# EAGLE schematic sequencer (EAGLE 9.6.1)
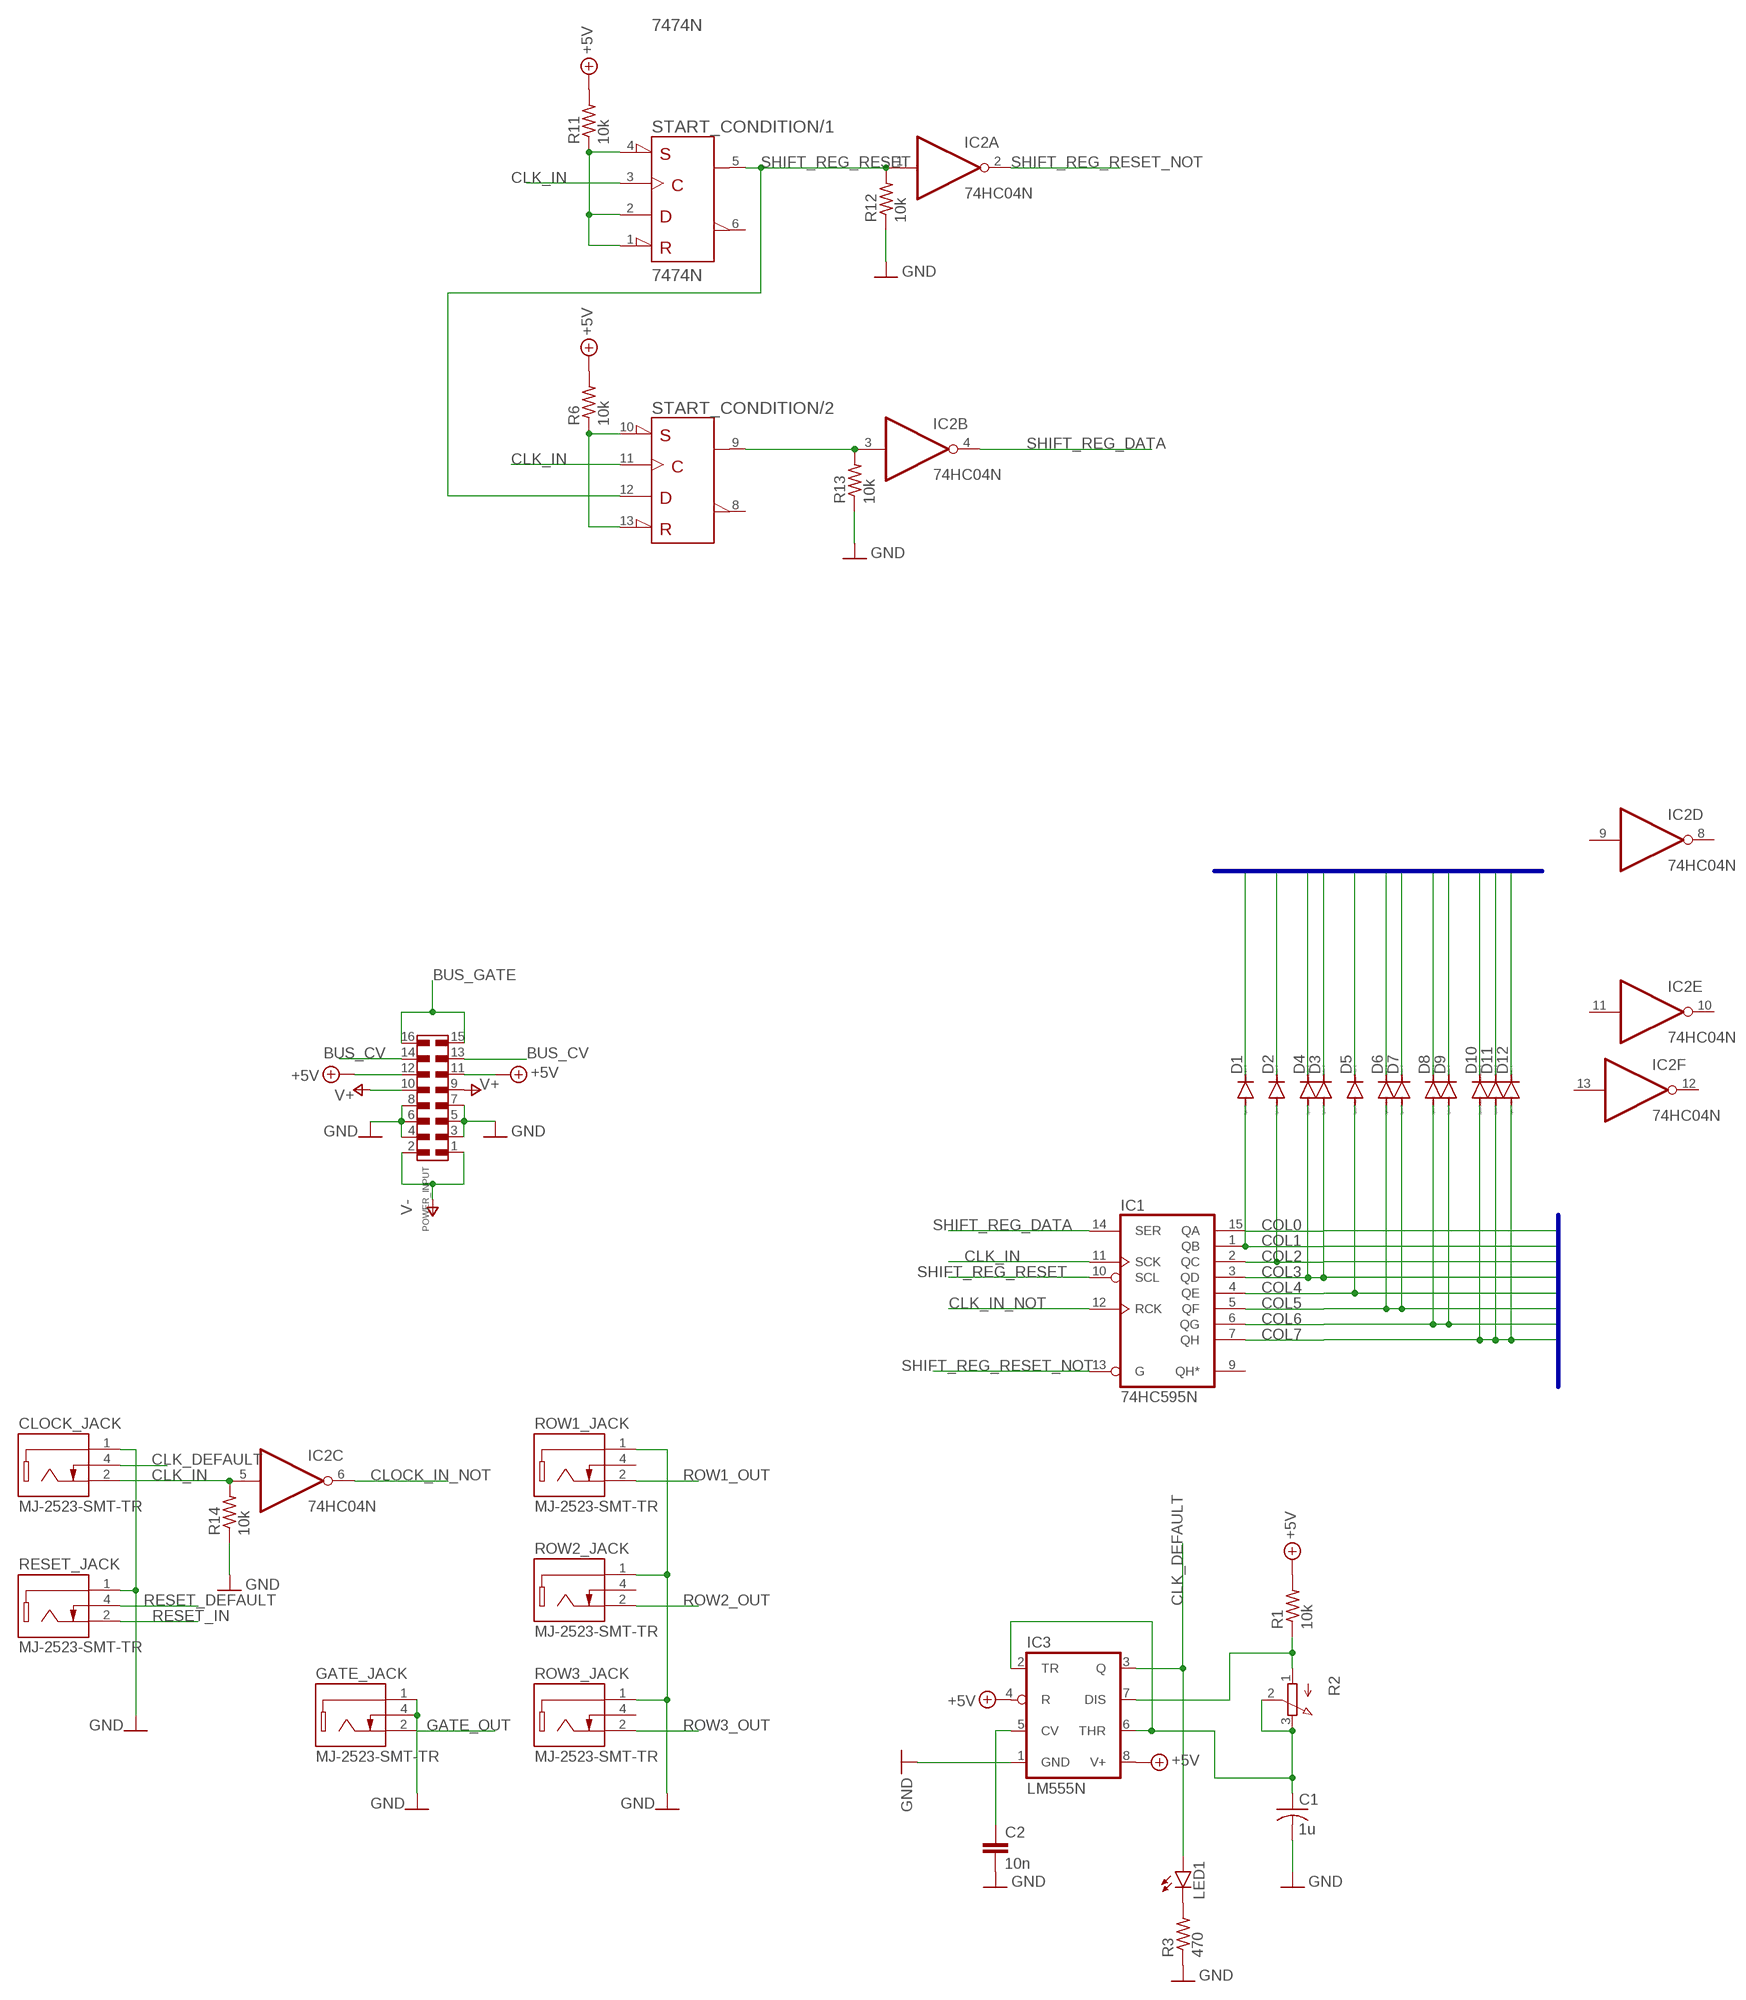
[diagram p0: schematic, sheet 1]

## Parts
C1  1u  C-US025-024X044  [C025-024X044]
C2  10n  C-EU025-024X044  [C025-024X044]
CLOCK_JACK  MJ-2523-SMT-TR  [MJ-2523-SMT-TR]
D1  DIODE-DO34-7  [DO34-7]
D2  DIODE-DO34-7  [DO34-7]
D3  DIODE-DO34-7  [DO34-7]
D4  DIODE-DO34-7  [DO34-7]
D5  DIODE-DO34-7  [DO34-7]
D6  DIODE-DO34-7  [DO34-7]
D7  DIODE-DO34-7  [DO34-7]
D8  DIODE-DO34-7  [DO34-7]
D9  DIODE-DO34-7  [DO34-7]
D10  DIODE-DO34-7  [DO34-7]
D11  DIODE-DO34-7  [DO34-7]
D12  DIODE-DO34-7  [DO34-7]
GATE_JACK  MJ-2523-SMT-TR  [MJ-2523-SMT-TR]
IC1  74HC595N  [DIL16]
IC2  74HC04N  [DIL14]
IC3  LM555N  [DIL08]
LED1  LED3MM  [LED3MM]
POWER_INPUT  6120XX20621_61201620621  [61201620621]
R1  10k  R-US_0204/7  [0204/7]
R2  3RP/1610N  [3RP/1610N]
R3  470  R-US_0204/7  [0204/7]
R6  10k  R-US_0204/7  [0204/7]
R11  10k  R-US_0204/7  [0204/7]
R12  10k  R-US_0204/7  [0204/7]
R13  10k  R-US_0204/7  [0204/7]
R14  10k  R-US_0204/7  [0204/7]
RESET_JACK  MJ-2523-SMT-TR  [MJ-2523-SMT-TR]
ROW1_JACK  MJ-2523-SMT-TR  [MJ-2523-SMT-TR]
ROW2_JACK  MJ-2523-SMT-TR  [MJ-2523-SMT-TR]
ROW3_JACK  MJ-2523-SMT-TR  [MJ-2523-SMT-TR]
START_CONDITION  7474N  [DIL14]

## Nets
+5V: IC3.4(R) IC3.8(V+) POWER_INPUT.11 POWER_INPUT.12 R1.2 R6.2 R11.2
BUS_CV: POWER_INPUT.13 POWER_INPUT.14
BUS_GATE: POWER_INPUT.15 POWER_INPUT.16
CLK_DEFAULT: CLOCK_JACK.4(TIP_SWITCH) IC3.3(Q) LED1.A
CLK_IN: CLOCK_JACK.2(TIP) IC1.11(SCK) IC2.5(C:I) R14.2 START_CONDITION.3(/1:CLK) START_CONDITION.11(/2:CLK)
CLK_IN_NOT: IC1.12(RCK)
CLOCK_IN_NOT: IC2.6(C:O)
COL0: IC1.15(QA)
COL1: D1.A IC1.1(QB)
COL2: D2.A IC1.2(QC)
COL3: D3.A D4.A IC1.3(QD)
COL4: D5.A IC1.4(QE)
COL5: D6.A D7.A IC1.5(QF)
COL6: D8.A D9.A IC1.6(QG)
COL7: D10.A D11.A D12.A IC1.7(QH)
GATE_OUT: GATE_JACK.2(TIP)
GND: C1.2 C2.2 CLOCK_JACK.1(SLEEVE) GATE_JACK.1(SLEEVE) GATE_JACK.4(TIP_SWITCH) IC3.1(GND) POWER_INPUT.3 POWER_INPUT.4 POWER_INPUT.5 POWER_INPUT.6 POWER_INPUT.7 POWER_INPUT.8 R3.1 R12.1 RESET_JACK.1(SLEEVE) ROW1_JACK.1(SLEEVE) ROW2_JACK.1(SLEEVE) ROW3_JACK.1(SLEEVE)
GND1: R13.1 ; supply symbol labelled GND
GND2: R14.1 ; supply symbol labelled GND
N$8: C2.1 IC3.5(CV)
N$9: C1.1 IC3.2(TR) IC3.6(THR) R2.2(S) R2.3(E)
N$10: LED1.K(C) R3.2
N$11: IC3.7(DIS) R1.1 R2.1(A)
N$15: R6.1 START_CONDITION.10(/2:!PRE) START_CONDITION.13(/2:!CLR)
N$16: IC2.3(B:I) R13.2 START_CONDITION.9(/2:Q)
N$24: R11.1 START_CONDITION.1(/1:!CLR) START_CONDITION.2(/1:D) START_CONDITION.4(/1:!PRE)
PLACE1: D1.C D4.C D6.C D10.C
PLACE2: D2.C D3.C D8.C D11.C
PLACE3: D5.C D7.C D9.C D12.C
RESET_DEFAULT: RESET_JACK.4(TIP_SWITCH)
RESET_IN: RESET_JACK.2(TIP)
ROW1_OUT: ROW1_JACK.2(TIP)
ROW2_OUT: ROW2_JACK.2(TIP)
ROW3_OUT: ROW3_JACK.2(TIP)
SHIFT_REG_DATA: IC1.14(SER) IC2.4(B:O)
SHIFT_REG_RESET: IC1.10(SCL) IC2.1(A:I) R12.2 START_CONDITION.5(/1:Q) START_CONDITION.12(/2:D)
SHIFT_REG_RESET_NOT: IC1.13(G) IC2.2(A:O)
V+: POWER_INPUT.9 POWER_INPUT.10
V-: POWER_INPUT.1 POWER_INPUT.2
Unconnected: IC1.9(QH*) IC2.8(D:O) IC2.9(D:I) IC2.10(E:O) IC2.11(E:I) IC2.12(F:O) IC2.13(F:I) ROW1_JACK.4(TIP_SWITCH) ROW2_JACK.4(TIP_SWITCH) ROW3_JACK.4(TIP_SWITCH) START_CONDITION.6(/1:!Q) START_CONDITION.8(/2:!Q)

## Buses
COLUMN:COL[0..7]
BINARY_COUNT:PLACE[1..3]

## Power pins joined to a net without a drawn wire
+UB: START_CONDITION.14(/+UB:+UB)
-UB: START_CONDITION.7(/-UB:-UB)
GND: IC1.8(GND) IC2.7(P:GND)
VCC: IC1.16(VCC) IC2.14(P:VCC)

## Library data of the parts
C1 = rcl:C-US: CAPACITOR, American symbol; SPICEPREFIX: C
C2 = rcl:C-EU: CAPACITOR, European symbol; SPICEPREFIX: C
CLOCK_JACK GATE_JACK RESET_JACK ROW1_JACK ROW2_JACK ROW3_JACK = Audio Connectors:MJ-2523-SMT-TR: CONN JACK MONO 2.5MM SMD R/A Manufacturer's datasheet <https://www.cuidevices.com/product/resource/mj-2523-smt-tr.pdf>; CREATED_BY: PCBLayout.com; DIGIKEY_PN: CP-2523MJTR-ND; MANUFACTURER: CUI Devices; MPN: MJ-2523-SMT-TR
D1-D12 = diode:DIODE-: DIODE
IC1 = 74xx-eu:74*595: 8-bit SHIFT REGISTER, output latch
IC2 = 74xx-eu:74*04: Hex INVERTER
IC3 = linear:*555: TIMER
LED1 = led:LED: LED OSRAM: - CHIPLED LG R971, LG N971, LY N971, LG Q971, LY Q971, LO R971, LY R971 LH N974, LH R974 LS Q976, LO Q976, LY Q976 LO Q996 - Hyper CHIPLED LW Q18S LB Q993, LB Q99A, LB R99A - SideLED LS A670, LO A670, LY A670, LG A670, LP A670 LB A673, LV A673, LT A673, LW A673 LH A674 LY A675 LS A676, LA A676, LO A676, LY A676, LW A676 LS A679, LY A679, LG A679 - Hyper Micro SIDELED® LS Y876, LA Y876, LO Y876, LY Y876 LT Y87S - SmartLED LW L88C, LW L88S LB L89C, LB L89S, LG L890 LS L89K, LO L89K, LY L89K LS L896, LA L896, LO L896, LY L896 - TOPLED LS T670, LO T670, LY T670, LG T670, LP T670 LSG T670, LSP T670, LSY T670, LOP T670, LYG T670 LG T671, LOG T671, LSG T671 LB T673, LV T673, LT T673, LW T673 LH T674 LS T676, LA T676, LO T676, LY T676, LB T676, LH T676, LSB T676, LW T676 LB T67C, LV T67C, LT T67C, LS T67K, LO T67K, LY T67K, LW E67C LS E67B, LA E67B, LO E67B, LY E67B, LB E67C, LV E67C, LT E67C LW T67C LS T679, LY T679, LG T679 LS T770, LO T770, LY T770, LG T770, LP T770 LB T773, LV T773, LT T773, LW T773 LH T774 LS E675, LA E675, LY E675, LS T675 LS T776, LA T776, LO T776, LY T776, LB T776 LHGB T686 LT T68C, LB T68C - Hyper Mini TOPLED® LB M676 - Mini TOPLED Santana® LG M470 LS M47K, LO M47K, LY M47K Source: http://www.osram.convergy.de LUXEON: - LUMILED® LXK2-PW12-R00, LXK2-PW12-S00, LXK2-PW14-U00, LXK2-PW14-V00 LXK2-PM12-R00, LXK2-PM12-S00, LXK2-PM14-U00 LXK2-PE12-Q00, LXK2-PE12-R00, LXK2-PE12-S00, LXK2-PE14-T00, LXK2-PE14-U00 LXK2-PB12-K00, LXK2-PB12-L00, LXK2-PB12-M00, LXK2-PB14-N00, LXK2-PB14-P00, LXK2-PB14-Q00 LXK2-PR12-L00, LXK2-PR12-M00, LXK2-PR14-Q00, LXK2-PR14-R00 LXK2-PD12-Q00, LXK2-PD12-R00, LXK2-PD12-S00 LXK2-PH12-R00, LXK2-PH12-S00 LXK2-PL12-P00, LXK2-PL12-Q00, LXK2-PL12-R00 Source: www.luxeon.com KINGBRIGHT: KA-3528ASYC Source: www.kingbright.com
POWER_INPUT = Wurth_Connectors_WR-BHD:6120XX20621_61201620621: WR-BHD 2.54 mm Male SMT Box Header KIND PROPERTIES: Pitch 2.54 mm Gender:Male MATERIAL PROPERTIES: Insulator Material:PA6T Insulator Flammability Rating UL94 V-0 Insulator Color:Black Contact Material :Copper Alloy Contact Plating :Gold Contact Type: Stamped GENERAL INFORMATION: Operating Temperature:-40 °C up to +125 °C Compliance:RoHS Working Voltage: 250 V (AC) Withstanding Voltage:500 V (AC) Contact Resistance: 20 mΩ Insulation Resistance:1000 MΩ CERTIFICATION: UL Approval:E323964 PACKAGING PROPERTIES Packaging :Tube <https://katalog.we-online.com/media/images/v2/o32919v209%20Family_WR-BHD_612xxx20621.jpg> Details see: https://katalog.we-online.com/en/em/BHD_2_54_SMT_MALE_BOX_HEADER_6120XX20621 Updated by Yingchun,Shan 2019-10-30 2019 (C) Würth Elektronik; CONTACT-RESISTANCE: 20mOhm; DATASHEET-URL: https://katalog.we-online.com/em/datasheet/61201620621.pdf; GENDER: Male; IR: 3A; L: 28.12mm; MOUNT: SMT; PACKAGING: Tube; PART-NUMBER: 61201620621; PINS: 16; PITCH: 2.54mm; TOL-R: max.; TYPE: Straight; WORKING-VOLTAGE: 250V(AC)
R1 R3 R6 R11-R14 = rcl:R-US_: RESISTOR, American symbol; SPICEPREFIX: R
R2 = pot:3RP/1610N: 16mm Potentiometer one level Source: http://www.alphapotentiometers.net/html/16mm_pot_2.html
START_CONDITION = 74ttl-din:74*74: Dual D type positive edge triggered FLIP FLOP, preset and clear